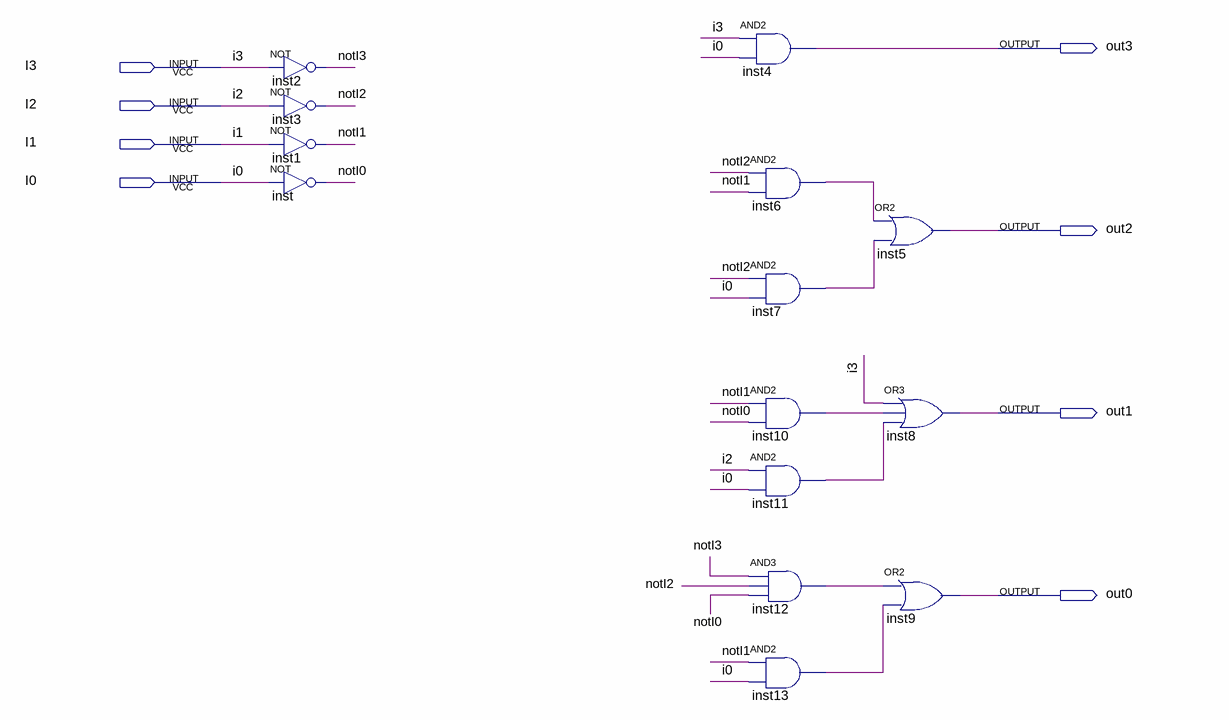
[diagram p0: schematic sheet]
// Quartus schematic out_circuit.bdf as structural Verilog: 14 symbols, 8 pins
module out_circuit (
  input  I3,
  input  I2,
  input  I1,
  input  I0,
  output out3,
  output out2,
  output out1,
  output out0
);

  wire inst6_out, inst7_out, inst10_out, inst11_out, inst12_out, inst13_out, notI0, notI1, notI2, notI3;

  not inst2 (notI3, I3);
  not inst3 (notI2, I2);
  not inst1 (notI1, I1);
  not inst (notI0, I0);
  and inst4 (out3, I3, I0);
  and inst6 (inst6_out, notI2, notI1);
  and inst7 (inst7_out, notI2, I0);
  and inst10 (inst10_out, notI1, notI0);
  and inst11 (inst11_out, I2, I0);
  and inst12 (inst12_out, notI3, notI2, notI0);
  and inst13 (inst13_out, notI1, I0);
  or inst5 (out2, inst6_out, inst7_out);
  or inst8 (out1, I3, inst10_out, inst11_out);
  or inst9 (out0, inst12_out, inst13_out);
endmodule
